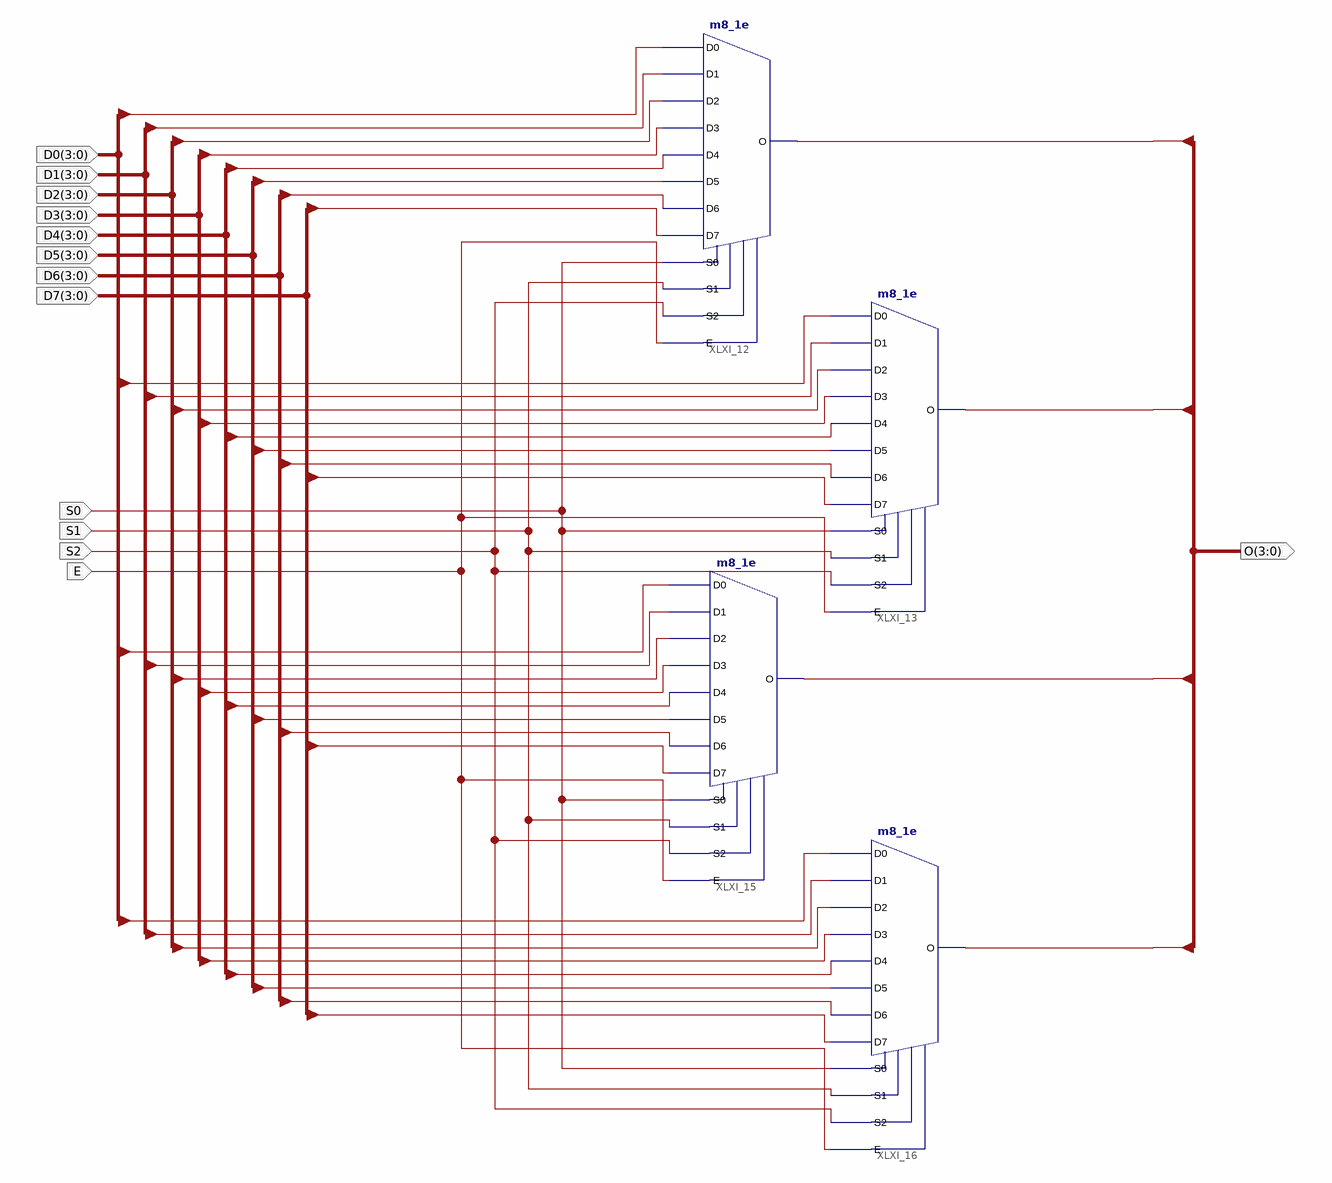
[diagram p0: schematic sheet 1]
// Xilinx ISE schematic Mux7x8x1.sch (spartan3e) as structural Verilog: 4 symbols, 13 ports
module Mux7x8x1 (
  input  E,
  input  S2,
  input  S1,
  input  S0,
  input  [3:0] D0,
  input  [3:0] D1,
  input  [3:0] D2,
  input  [3:0] D3,
  input  [3:0] D4,
  input  [3:0] D5,
  input  [3:0] D6,
  input  [3:0] D7,
  output [3:0] O
);

  m8_1e XLXI_15 (
    .D0(D0[2]), .D1(D1[2]), .D2(D2[2]), .D3(D3[2]), .D4(D4[2]), .D5(D5[2]), .D6(D6[2]), .D7(D7[2]), .E(E),
    .S0(S0), .S1(S1), .S2(S2), .O(O[2]));
  m8_1e XLXI_16 (
    .D0(D0[3]), .D1(D1[3]), .D2(D2[3]), .D3(D3[3]), .D4(D4[3]), .D5(D5[3]), .D6(D6[3]), .D7(D7[3]), .E(E),
    .S0(S0), .S1(S1), .S2(S2), .O(O[3]));
  m8_1e XLXI_12 (
    .D0(D0[0]), .D1(D1[0]), .D2(D2[0]), .D3(D3[0]), .D4(D4[0]), .D5(D5[0]), .D6(D6[0]), .D7(D7[0]), .E(E),
    .S0(S0), .S1(S1), .S2(S2), .O(O[0]));
  m8_1e XLXI_13 (
    .D0(D0[1]), .D1(D1[1]), .D2(D2[1]), .D3(D3[1]), .D4(D4[1]), .D5(D5[1]), .D6(D6[1]), .D7(D7[1]), .E(E),
    .S0(S0), .S1(S1), .S2(S2), .O(O[1]));
endmodule
